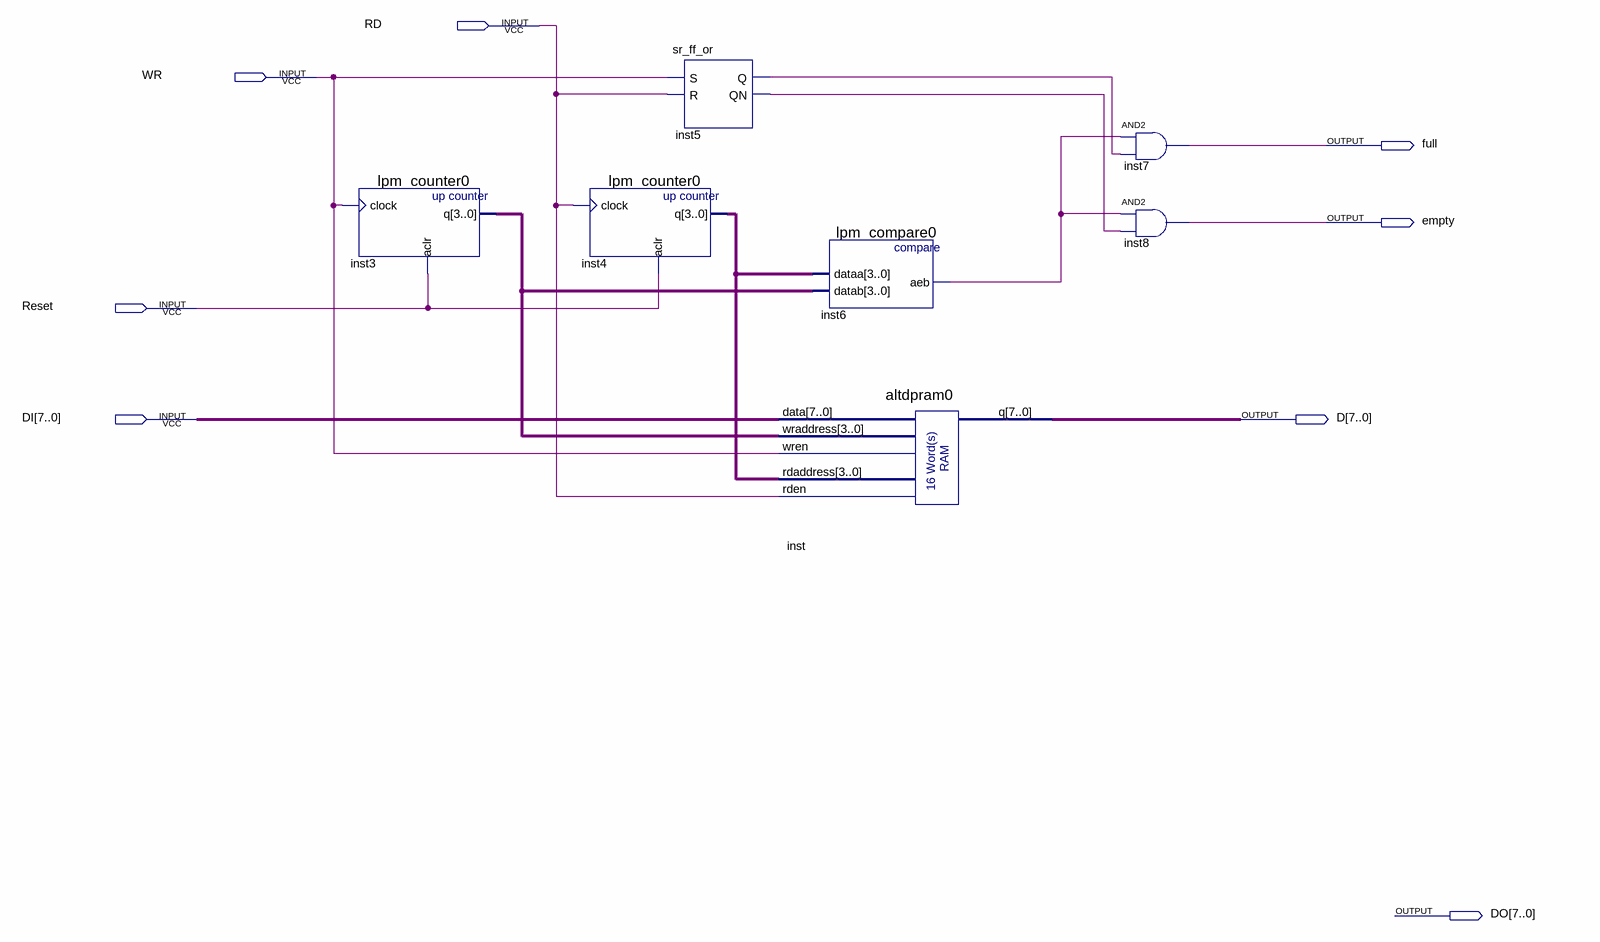
[diagram p0: schematic sheet]
// Quartus schematic fifo2.bdf as structural Verilog: 7 symbols, 8 pins
module fifo2 (
  input  RD,
  input  WR,
  input  Reset,
  input  [7:0] DI,
  output full,
  output empty,
  output [7:0] D,
  output [7:0] DO
);

  wire inst5_q, inst5_qn, inst6_aeb;
  wire [3:0] inst3_q, inst4_q;

  lpm_counter0 inst3 (.clock(WR), .aclr(Reset), .q(inst3_q));
  lpm_counter0 inst4 (.clock(RD), .aclr(Reset), .q(inst4_q));
  sr_ff_or inst5 (.S(WR), .R(RD), .Q(inst5_q), .QN(inst5_qn));
  lpm_compare0 inst6 (.dataa(inst4_q), .datab(inst3_q), .aeb(inst6_aeb));
  altdpram0 inst (.data(DI), .wraddress(inst3_q), .wren(WR), .rdaddress(inst4_q), .rden(RD), .q(D));
  and inst7 (full, inst6_aeb, inst5_q);
  and inst8 (empty, inst6_aeb, inst5_qn);
endmodule
